# Altium schematic sheet Key_RGB_Sensor_Uart.SchDoc: RaspberryPi_Hat
size A4; Revision: V0.1; SheetNumber: X; SheetTotal: Y; Function: 按键，RGB, 传感器，串口; number: 3; totle: 3
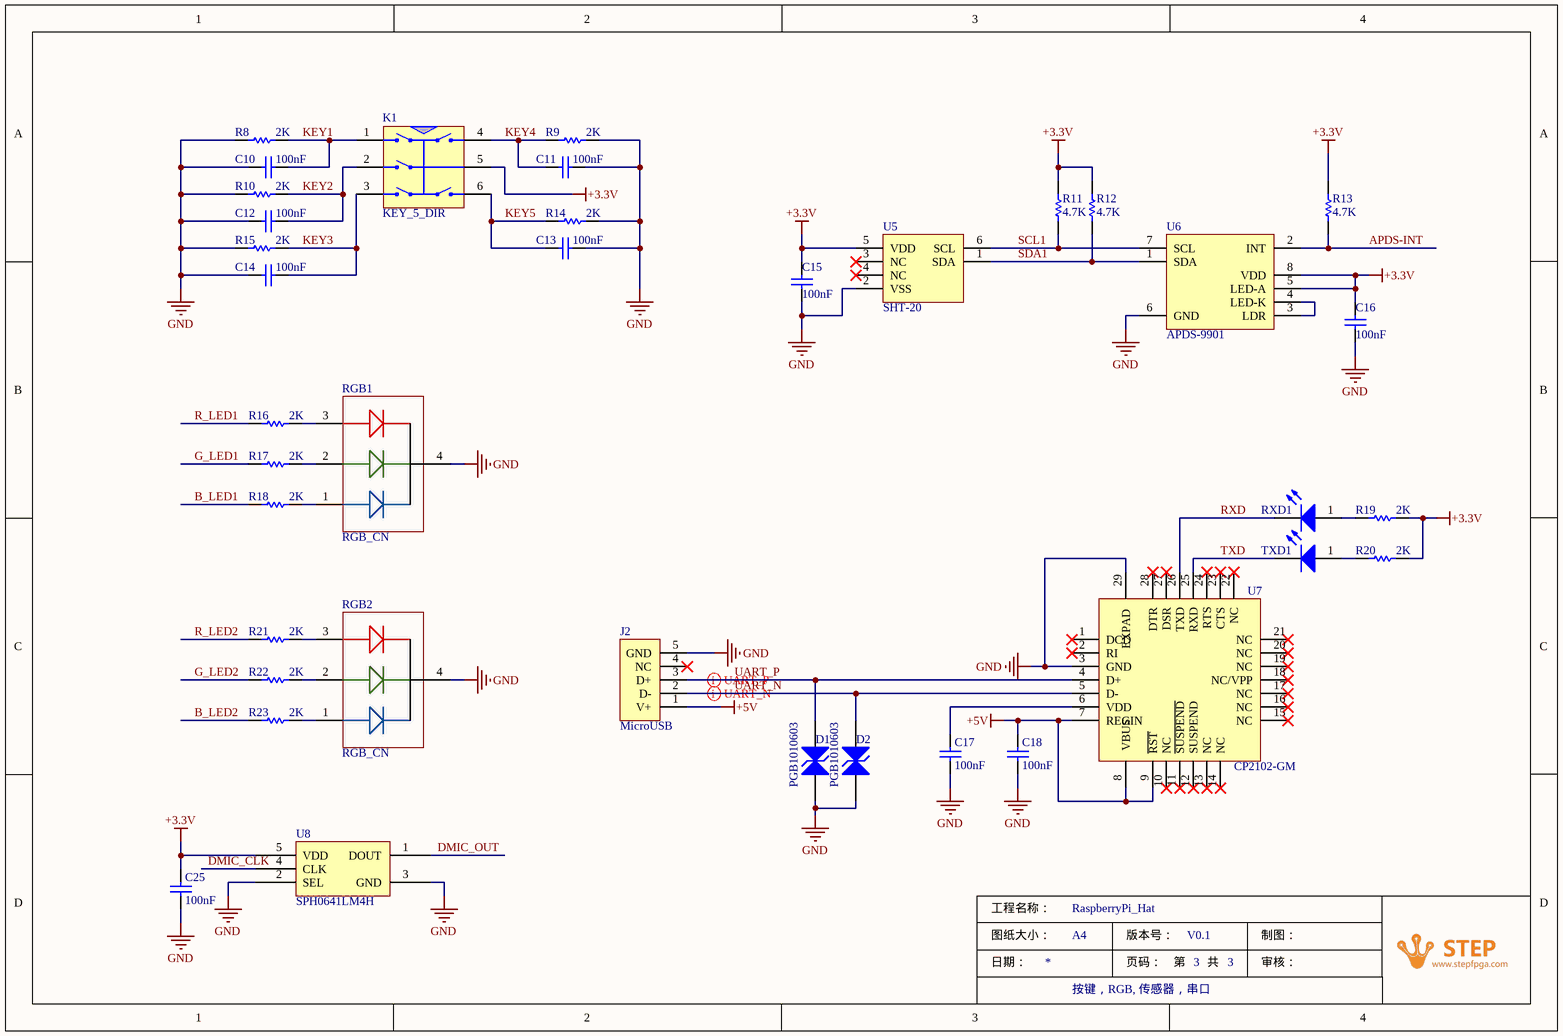
[diagram p0: Key_RGB_Sensor_Uart.SchDoc]

## Parts
C10  100nF  [C0603]
C11  100nF  [C0603]
C12  100nF  [C0603]
C13  100nF  [C0603]
C14  100nF  [C0603]
C15  100nF  [C0603]
C16  100nF  [C0603]
C17  100nF  [C0603]
C18  100nF  [C0603]
C25  100nF  [C0603]
D1  PGB1010603  [C0603]
D2  PGB1010603  [C0603]
J2  MicroUSB  [MICRO_USB_4]
K1  KEY_5_DIR  [KEY-CH5]
R8  2K  [R0603]
R9  2K  [R0603]
R10  2K  [R0603]
R11  4.7K  [R0603]
R12  4.7K  [R0603]
R13  4.7K  [R0603]
R14  2K  [R0603]
R15  2K  [R0603]
R16  2K  [R0603]
R17  2K  [R0603]
R18  2K  [R0603]
R19  2K  [R0603]
R20  2K  [R0603]
R21  2K  [R0603]
R22  2K  [R0603]
R23  2K  [R0603]
RGB1  RGB_CN  [RGB_LEDCN]
RGB2  RGB_CN  [RGB_LEDCN]
RXD1  LED  [LED0603]  (value not drawn)
TXD1  LED  [LED0603]  (value not drawn)
U5  SHT-20  [SHT20]
U6  APDS-9901  [APDS9901]
U7  CP2102-GM  [QFN5*5_28]
U8  SPH0641LM4H  [SPH(3.5*2.65)]

## Nets
+3.3V: C15.2 C16.2 C25.2 K1.5(COM) R11.2 R12.2 R13.2 R19.1 R20.1 U5.5(VDD) U6.5(LED-A) U6.8(VDD) U8.5(VDD)
+5V: C18.2 J2.1(V+) U7.7(REGIN) U7.8(VBUS) U7.9(~{RST})
GND: C10.2 C11.1 C12.2 C13.1 C14.2 C15.1 C16.1 C17.1 C18.1 C25.1 D1.1(A) D2.1(A) J2.5(GND) R8.2 R9.1 R10.2 R14.1 R15.2 RGB1.4(COM) RGB2.4(COM) U5.2(VSS) U6.6(GND) U7.3(GND) U7.29(EXPAD) U8.2(SEL) U8.3(GND)
APDS-INT: R13.1 U6.2(INT)
B_LED1: R18.2
B_LED2: R23.2
DMIC_CLK: U8.4(CLK)
DMIC_OUT: U8.1(DOUT)
G_LED1: R17.2
G_LED2: R22.2
KEY1: C10.1 K1.1(COM) R8.1
KEY2: C12.1 K1.2(COM) R10.1
KEY3: C14.1 K1.3(COM) R15.1
KEY4: C11.2 K1.4(COM) R9.2
KEY5: C13.2 K1.6(COM) R14.2
R_LED1: R16.2
R_LED2: R21.2
RXD: RXD1.2(K) U7.26(TXD)
SCL1: R11.1 U5.6(SCL) U6.7(SCL)
SDA1: R12.1 U5.1(SDA) U6.1(SDA)
TXD: TXD1.2(K) U7.25(RXD)
UART_N: D2.2(K) J2.2(D-) U7.5(D-)
UART_P: D1.2(K) J2.3(D+) U7.4(D+)
NetC17_2: C17.2 U7.6(VDD)
NetR16_1: R16.1 RGB1.3(G)
NetR17_1: R17.1 RGB1.2(G)
NetR18_1: R18.1 RGB1.1(B)
NetR19_2: R19.2 RXD1.1(A)
NetR20_2: R20.2 TXD1.1(A)
NetR21_1: R21.1 RGB2.3(G)
NetR22_1: R22.1 RGB2.2(G)
NetR23_1: R23.1 RGB2.1(B)
NetU6_3: U6.3(LDR) U6.4(LED-K)

Not connected (* = marked no-connect by the designer): J2 4(NC)*; U5 3(NC)* 4(NC)*; U7 1(DCD)* 2(RI)* 10(NC)* 11(~{SUSPEND})* 12(SUSPEND)* 13(NC)* 14(NC)* 15(NC)* 16(NC)* 17(NC)* 18(NC/VPP)* 19(NC)* 20(NC)* 21(NC)* 22(NC)* 23(CTS)* 24(RTS)* 27(DSR)* 28(DTR)*

## Layout directives
differential pair: UART_N, UART_P

## Notes on the sheet
- 工程名称：
- 图纸大小：
- 日期：
- A4
- 版本号：
- 页码：
- 第
- 共
- 制图：
- 审核：

## Library data of the parts
C10-C16 = Cap Semi: Capacitor (Semiconductor SIM Model); Published: 8-Jun-2000; LatestRevisionDate: 29-May-2009; LatestRevisionNote: IPC-7351 Footprint Added.; PackageReference: C1206; Publisher: Altium Limited; PackageDescription: Chip Capacitor; Value: 100nF
C17 C18 C25 = Cap: Capacitor; Value: 100nF 封装0402 精度20% 耐压值6.3V以上; Published: 8-Jun-2000; LatestRevisionDate: 17-Jul-2002; LatestRevisionNote: Re-released for DXP Platform.; PackageReference: RAD-0.3; Publisher: Altium Limited; PackageDescription: Radial Cap, Thru-Hole; 2 Leads; 0.3 in Pin Spacing
D1 D2 = PGB1010603: ESD 抑制器 0603 24VDC .06pF; Manufacture: Littelfuse; Value: ESD抑制器 PGB1010603MR
J2 = Micro USB Header: FootPrint: *; Part Number: *; Price: *; Manufacture: *
K1 = KEY_5_DIR: 五向按键开关，摇杆; Value: 五向开关
R8-R23 = Res1: Resistor; Published: 8-Jun-2000; LatestRevisionDate: 17-Jul-2002; LatestRevisionNote: Re-released for DXP Platform.; PackageReference: AXIAL-0.3; Publisher: Altium Limited; PackageDescription: Axial Device, Thru-Hole; 2 Leads; 0.3 in Pin Spacing
  R8-R10 R14-R23: Value: 2K
  R11-R13: Value: 4.7K
RXD1 TXD1 = LED: Typical INFRARED GaAs LED,1.8V,10mA,Red; Value: 贴片LED 0603封装 绿色; Part Number: *; FootPrint: *; Manufacture: *
U5 = SHT-20: 温湿度传感器; Value: SHT-20
U6 = APDS-9901: 接近式传感器; Value: APDS-9901
U7 = CP2102: CP2102，USB转串口UART驱动芯片; Value: CP2102-GM
U8 = SPH0641LM4H: 数字麦克风